# Altium schematic sheet switcher1V35.SchDoc: 1.35V Supply
size Legal; CheckedBy: J. Brinton; CompanyName: Signal Laboratories, Inc.; DrawnBy: J. Brinton; Engineer: J. Brinton; Address1: 3479 Edison Way; Address2: Menlo Park CA 94025; Address3: +1 (877) 778-8435; Address4: siglabs.com; DocumentNumber: 9; Revision: 2b; SheetNumber: 10; SheetTotal: 58
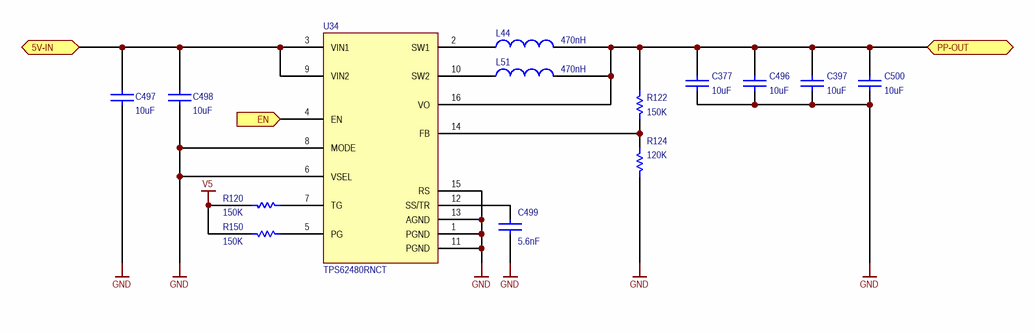
[diagram p0: switcher1V35.SchDoc]

## Parts
C377  value 10uF  [0603]  (hidden comment: CL10A106MA8NRNC)
C397  value 10uF  [0603]  (hidden comment: CL10A106MA8NRNC)
C496  value 10uF  [0603]  (hidden comment: CL10A106MA8NRNC)
C497  value 10uF  [0603]  (hidden comment: CL10A106MA8NRNC)
C498  value 10uF  [0603]  (hidden comment: CL10A106MA8NRNC)
C499  value 5.6nF  [0603]  (hidden comment: C1608C0G1H562J080AA)
C500  value 10uF  [0603]  (hidden comment: CL10A106MA8NRNC)
L44  value 470nH  [DFE2520]  (hidden comment: DFE252012F-R47M=P2)
L51  value 470nH  [DFE2520]  (hidden comment: DFE252012F-R47M=P2)
R120  value 150K  [0402]  (hidden comment: ERJ-2RKF1503X)
R122  value 150K  [0402]  (hidden comment: ERJ-2RKF1503X)
R124  value 120K  [0402]  (hidden comment: ERJ-2RKF1203X)
R150  value 150K  [0402]  (hidden comment: ERJ-2RKF1503X)
U34  TPS62480RNCT  [RNC-VQFN-16]

## Ports
5V-IN, EN (in), PP-OUT

## Nets
GND: C377.1 C397.1 C496.1 C497.1 C498.1 C499.1 C500.1 R124.2 U34.1(PGND) U34.6(VSEL) U34.8(MODE) U34.11(PGND) U34.13(AGND) U34.15(RS)
V5: R120.1 R150.1
5V-IN: C497.2 C498.2 U34.3(VIN1) U34.9(VIN2) ; port 5V-IN
EN: U34.4(EN) ; port EN
PP-OUT: C377.2 C397.2 C496.2 C500.2 L44.2 L51.2 R122.1 U34.16(VO) ; port PP-OUT
NetC499_2: C499.2 U34.12(SS/TR)
NetL44_1: L44.1 U34.2(SW1)
NetL51_1: L51.1 U34.10(SW2)
NetR120_2: R120.2 U34.7(TG)
NetR122_2: R122.2 R124.1 U34.14(FB)
NetR150_2: R150.2 U34.5(PG)

## Notes on the sheet
- Title
- Engineer
- Revision
- Drawn By
- Checked By
- Date
- Sheet
- of

## Library data of the parts
C377 C397 C496-C498 C500 = CAP 0603: Ceramic Capacitor 10uF ±20% 25V X5R 0603; Manufacturer: Samsung; Tr: -55:85; Manufacturer P/N: CL10A106MA8NRNC; Voltage: 25V; Package: 0603; Tolerance: ±20%
C499 = CAP 0402: Ceramic Capacitor 5.6nF ±5% 50V NP0 0603; Manufacturer: TDK; Tr: -55:125; Voltage: 50V; Manufacturer P/N: C1608C0G1H562J080AA; Package: 0603; Tolerance: ±5%
L44 L51 = Inductor: Shielded Powdered Iron Power Inductor 470nH ±20% 4.9A SMD; Manufacturer: Murata; Tr: -40:125; Manufacturer P/N: DFE252012F-R47M=P2; Package: 1008; Tolerance: ±20%
R120 R122 R150 = RES 0402: Thick Film Resistor 150k ±1% 0402; Manufacturer: Panasonic; Tr: -55:155; Package: 0402; Manufacturer P/N: ERJ-2RKF1503X; Tolerance: ±1%
R124 = RES 0402: Thick Film Resistor 120k ±1% 0402; Manufacturer: Panasonic; Tr: -55:155; Package: 0402; Manufacturer P/N: ERJ-2RKF1203X; Tolerance: ±1%
U34 = TPS62480: 6A Dual Phase Ultra-Compact Buck Supply; Manufacturer: Texas Instruments; Manufacturer P/N: TPS62480RNCT